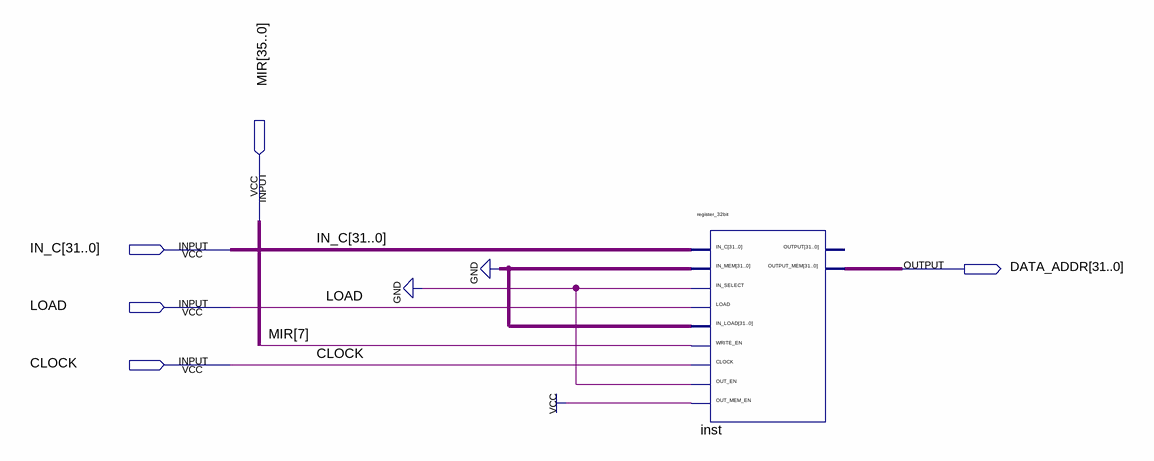
[diagram p0: schematic sheet]
// Quartus schematic MAR.bdf as structural Verilog: 1 symbols, 5 pins
module MAR (
  input  [35:0] MIR,
  input  [31:0] IN_C,
  input  LOAD,
  input  CLOCK,
  output [31:0] DATA_ADDR
);

  register_32bit inst (
    .IN_LOAD({32{1'b0}}), .IN_C(IN_C), .LOAD(LOAD), .IN_MEM({32{1'b0}}), .IN_SELECT(1'b0), .WRITE_EN(MIR[7]),
    .CLOCK(CLOCK), .OUT_EN(1'b0), .OUT_MEM_EN(1'b1), .OUTPUT_MEM(DATA_ADDR));  // open: OUTPUT
endmodule
